# Altium schematic sheet QCopterFly_NRF_Sch.SchDoc
size A4
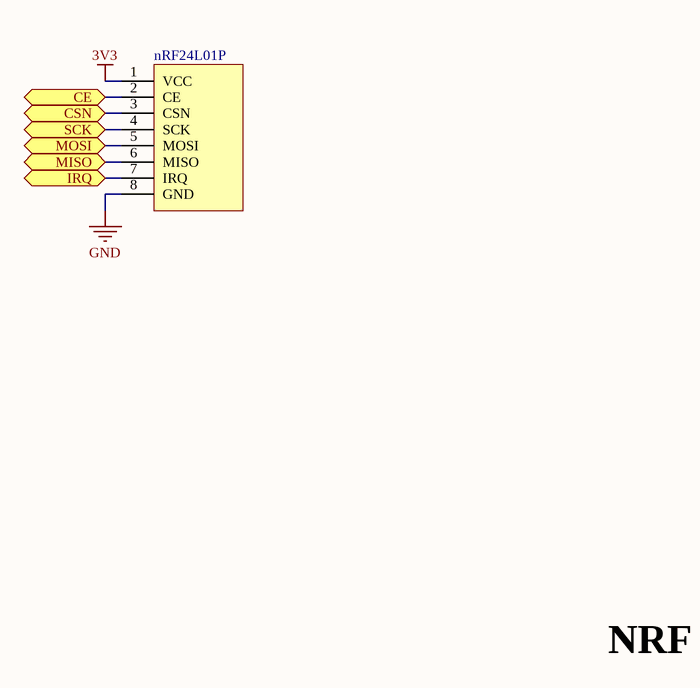
[diagram p0: QCopterFly_NRF_Sch.SchDoc]

## Parts
nRF24L01P  nRF24L01P_PA_LNA  [NRF24L01P_PA_LNA]  (value not drawn)

## Ports
CE, CSN, IRQ, MISO, MOSI, SCK

## Nets
3V3: nRF24L01P.1(VCC)
GND: nRF24L01P.8(GND)
CE: nRF24L01P.2(CE) ; port CE
CSN: nRF24L01P.3(CSN) ; port CSN
IRQ: nRF24L01P.7(IRQ) ; port IRQ
MISO: nRF24L01P.6(MISO) ; port MISO
MOSI: nRF24L01P.5(MOSI) ; port MOSI
SCK: nRF24L01P.4(SCK) ; port SCK

## Notes on the sheet
- NRF

## Library data of the parts
nRF24L01P = nRF24L01P_PA_LNA: Module